# Altium project PowerSupply.PrjPcb
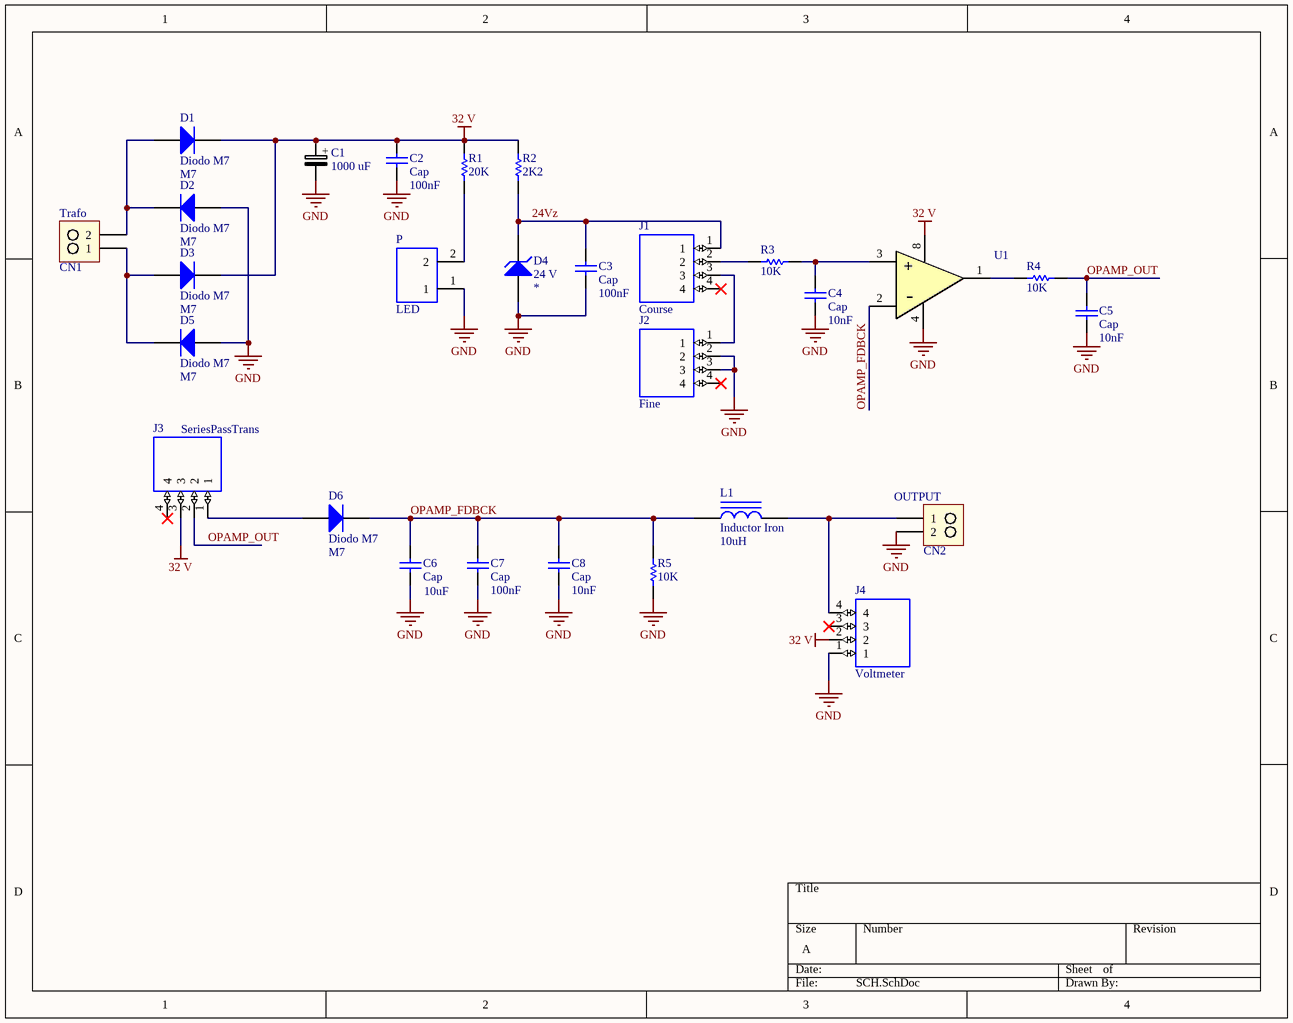
[diagram p0: SCH.SchDoc]
1 sheet, 28 parts. Net scope: global (net labels, ports and power ports of the same name join across sheets).
Board file: PCB_PL.PcbDoc

## Sheet SCH.SchDoc
size A

### Parts
C1  value 1000 uF  [CAP-POL-D12.5-P5.0]  (hidden comment: Cap Pol)
C2  Cap  value 100nF  [SMD0805]
C3  Cap  value 100nF  [SMD0805]
C4  Cap  value 10nF  [SMD1210]
C5  Cap  value 10nF  [SMD1210]
C6  Cap  value 10uF  [SMD0805]
C7  Cap  value 100nF  [SMD0805]
C8  Cap  value 10nF  [SMD1210]
CN1  Trafo  [BORNE 2Vias]
CN2  OUTPUT  [BORNE 2Vias]
D1  Diodo M7  value M7  [DIODE_DO-214AC]
D2  Diodo M7  value M7  [DIODE_DO-214AC]
D3  Diodo M7  value M7  [DIODE_DO-214AC]
D4  24 V  [Resistor 1/4W]
D5  Diodo M7  value M7  [DIODE_DO-214AC]
D6  Diodo M7  value M7  [DIODE_DO-214AC]
J1  Course  [470533000]
J2  Fine  [470533000]
J3  SeriesPassTrans  [470533000]
J4  Voltmeter  [470533000]
L1  Inductor Iron  value 10uH  [WURTH_6823]
P  LED  [MOLEX_0022272021]
R1  value 20K  [Resistor0805]  (hidden comment: Res1)
R2  value 2K2  [Resistor0805]  (hidden comment: Res1)
R3  value 10K  [Resistor0805]  (hidden comment: Res1)
R4  value 10K  [Resistor0805]  (hidden comment: Res1)
R5  value 10K  [Resistor0805]  (hidden comment: Res1)
U1  LM358  [DIP8]  (value not drawn)

### Nets
32 V: C1.1 C2.2 D1.2(K) D3.2(K) J3.3 J4.2 R1.2 R2.2 U1.8
GND: C1.2 C2.1 C3.1 C4.1 C5.1 C6.1 C7.1 C8.1 CN2.2 D2.1(A) D4.1(A) D5.1(A) J2.2 J2.3 J4.1 P.1 R5.1 U1.4
24Vz: C3.2 D4.2(K) J1.1 R2.1
OPAMP_FDBCK: C6.2 C7.2 C8.2 D6.2(K) L1.1 R5.2 U1.2
OPAMP_OUT: C5.2 J3.2 R4.1
NetC4_2: C4.2 R3.1 U1.3
NetCN1_1: CN1.1 D3.1(A) D5.2(K)
NetCN1_2: CN1.2 D1.1(A) D2.2(K)
NetCN2_1: CN2.1 J4.4 L1.2
NetD6_1: D6.1(A) J3.1
NetJ1_2: J1.2 R3.2
NetJ1_3: J1.3 J2.1
NetP_2: P.2 R1.1
NetR4_2: R4.2 U1.1

Not connected (* = marked no-connect by the designer): J1 4*; J2 4*; J3 4*; J4 3*

### Notes on the sheet
- (in symbol Cap Pol) +
- (in symbol LM358) +; -

### Library data of the parts
C1 = Cap Pol: Capacitor eletrolítico
C2-C8 = Cap: Capacitor; Published: 8-Jun-2000; LatestRevisionDate: 17-Jul-2002; LatestRevisionNote: Re-released for DXP Platform.; PackageReference: RAD-0.3; Publisher: Altium Limited; PackageDescription: Radial Cap, Thru-Hole; 2 Leads; 0.3 in Pin Spacing
CN1 CN2 = BORNE-2: Borne 2 vias; Value: AKZ700-2; PartNum: AKZ700-2; CodigoERP: *
D1-D3 D5 D6 = Diodo M7: 1 Amp General Purpose Rectifier; pin to pad: 1>A 2>K; Published: 8-Jun-2000; LatestRevisionDate: 17-Jul-2002; LatestRevisionNote: Re-released for DXP Platform.; DatasheetVersion: 1998; PackageVersion: Aug-1999; PackageReference: DO-41; Publisher: Altium Limited; PackageDescription: Diode, Axial; Body 5.2 x 2.7 mm (LxDia. max), Lead Dia. 0.86 mm (max); Code_JEDEC: DO-204-AL; ComponentLink1Description: Manufacturer Link; ComponentLink1URL: http://www.fairchildsemi.com/; ComponentLink2Description: Datasheet; ComponentLink2URL: http://www.fairchildsemi.com/ds/1N%2F1N4001.pdf
D4 = Diodo zener TVS: Zener Diode; Published: 8-Jun-2000; LatestRevisionDate: 17-Jul-2002; LatestRevisionNote: Re-released for DXP Platform.; PackageReference: DIODE-0.7; Publisher: Altium Limited; PackageDescription: Diode, Thru-Hole; 2 Leads; 0.7 in Pin Spacing; Value: *
J1-J4 = 47053-3000: KKÂ® 254 Vertical Header, with Friction Lock, 4 Circuits, PC Tail Length: 4.00mm; MF: Molex; Check_prices: https://www.snapeda.com/parts/47053-3000/Molex/view-part/623783/?ref=eda; Package: None; Price: None; Value: *; MP: 47053-3000; Purchase-URL: https://pricing.snapeda.com/search/part/47053-3000/?ref=eda; Availability: Warning; SnapEDA_Link: https://www.snapeda.com/parts/47053-3000/Molex/view-part/623783/?ref=snap
L1 = Inductor Iron: Magnetic-Core Inductor; Published: 24-Mar-1999; LatestRevisionDate: 17-Jul-2002; LatestRevisionNote: Re-released for DXP Platform.; PackageReference: AXIAL-0.9; Publisher: Altium Limited; PackageDescription: Axial Device, Thru-Hole; 2 Leads; 0.9 in Pin Spacing
P = 0022272021: Connector Header Through Hole 2 position 0.100 _2.54mm_; MF: Molex; SnapEDA_Link: https://www.snapeda.com/parts/0022272021/Molex/view-part/424357/?ref=snap; Availability: Unavailable; Package: None; Price: None; MP: 0022272021; Value: *
R1-R5 = Res1: Resistor; Published: 8-Jun-2000; LatestRevisionDate: 17-Jul-2002; LatestRevisionNote: Re-released for DXP Platform.; PackageReference: AXIAL-0.3; Publisher: Altium Limited; PackageDescription: Axial Device, Thru-Hole; 2 Leads; 0.3 in Pin Spacing